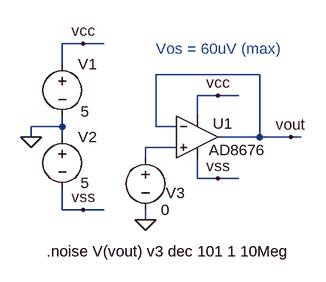
[diagram p0: schematic 04-ad8676_input_voltage_noise.asc]
04-ad8676_input_voltage_noise.asc, the LTspice schematic file:
Version 4
SHEET 1 880 680
WIRE -48 16 -80 16
WIRE -16 16 -48 16
WIRE -80 48 -80 16
WIRE 224 64 64 64
WIRE 160 96 128 96
WIRE 192 96 160 96
WIRE 128 128 128 96
WIRE -80 144 -80 128
WIRE -80 144 -128 144
WIRE 64 144 64 64
WIRE 96 144 64 144
WIRE -128 160 -128 144
WIRE -80 160 -80 144
WIRE 224 160 224 64
WIRE 224 160 160 160
WIRE 272 160 224 160
WIRE 288 160 272 160
WIRE 96 176 48 176
WIRE 48 192 48 176
WIRE 128 224 128 192
WIRE 160 224 128 224
WIRE 192 224 160 224
WIRE -80 272 -80 240
WIRE -48 272 -80 272
WIRE -16 272 -48 272
WIRE 48 288 48 272
FLAG -128 160 0
FLAG -48 272 vss
FLAG -48 16 vcc
FLAG 160 96 vcc
FLAG 160 224 vss
FLAG 48 288 0
FLAG 272 160 vout
SYMBOL voltage -80 32 R0
WINDOW 3 28 89 Left 2
SYMATTR Value 5
SYMATTR InstName V1
SYMBOL voltage -80 144 R0
WINDOW 3 28 87 Left 2
SYMATTR Value 5
SYMATTR InstName V2
SYMBOL OpAmps\\AD8676 128 96 R0
WINDOW 0 24 43 Left 2
WINDOW 3 18 84 Left 2
SYMATTR InstName U1
SYMBOL voltage 48 176 R0
WINDOW 0 32 70 Left 2
SYMATTR InstName V3
SYMATTR Value 0
TEXT -104 336 Left 2 !.noise V(vout) v3 dec 101 1 10Meg
TEXT 64 24 Left 2 ;Vos = 60uV (max)

The netlist it stands for:
* 04-ad8676_input_voltage_noise.asc
V1 vcc 0 5
V2 0 vss 5
XU1 N001 vout vcc vss vout AD8676  ; pins In+ In- V+ V- OUT
V3 N001 0 0
.noise V(vout) v3 dec 101 1 10Meg
* Vos = 60uV (max)
.backanno
.end